# Altium schematic sheet PwrConfig.SchDoc
size A; SheetNumber: 2; SheetTotal: 2; DocumentName: Power and Configuration
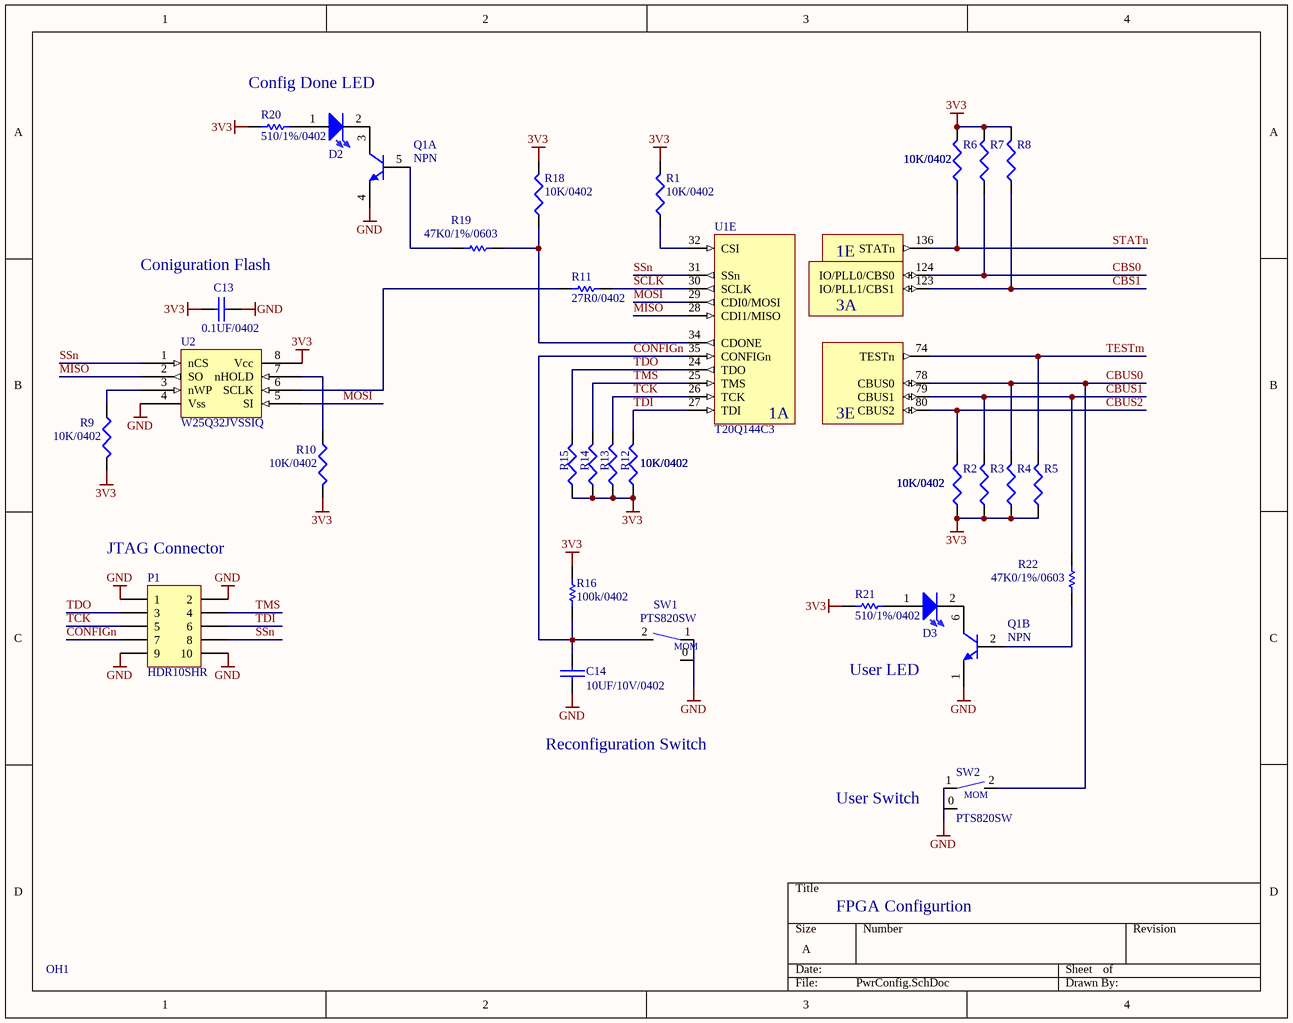
[diagram p0: PwrConfig.SchDoc]

## Parts
C13  0.1UF/0402  [0402]
C14  10UF/10V/0402  [0402]
D2  LTST-C191KGKT  [LED0603]  (value not drawn)
D3  LTST-C191KGKT  [LED0603]  (value not drawn)
OH1  OPENHW_SCH  (value not drawn)
P1  HDR10SHR  [HDR10]
Q1  NPN  [SC70-6_HAND]  (parts A,B of 2)
R1  10K/0402  [0402]
R2  10K/0402  [0402]
R3  10K/0402  [0402]
R4  10K/0402  [0402]
R5  10K/0402  [0402]
R6  10K/0402  [0402]
R7  10K/0402  [0402]
R8  10K/0402  [0402]
R9  10K/0402  [0402]
R10  10K/0402  [0402]
R11  27R0/0402  [0402]
R12  10K/0402  [0402]
R13  10K/0402  [0402]
R14  10K/0402  [0402]
R15  10K/0402  [0402]
R16  100k/0402  [0402]
R18  10K/0402  [0402]
R19  47K0/1%/0603  [0402]
R20  510/1%/0402  [0402]
R21  510/1%/0402  [0402]
R22  47K0/1%/0603  [0402]
SW1  PTS820SW  [PTS820]
SW2  PTS820SW  [PTS820]
U1  T20Q144C3  [LQFP144]  (part E of 6)
U2  W25Q32JVSSIQ  [so8w]

## Nets
3V3: C13.2 R1.2 R2.1 R3.1 R4.1 R5.1 R6.2 R7.2 R8.2 R9.2 R10.2 R12.1 R13.1 R14.1 R15.1 R16.2 R18.2 R20.2 R21.2 U2.8(Vcc)
GND: C13.1 C14.2 P1.1 P1.2 P1.9 P1.10 Q1.1 Q1.4 SW1.1 SW2.1 U2.4(Vss)
CBS0: R7.1 U1.124(IO/PLL0/CBS0)
CBS1: R8.1 U1.123(IO/PLL1/CBS1)
CBUS0: R4.2 SW2.2 U1.78(CBUS0)
CBUS1: R3.2 R22.2 U1.79(CBUS1)
CBUS2: R2.2 U1.80(CBUS2)
CONFIGn: C14.1 P1.7 R16.1 SW1.2 U1.35(CONFIGn)
MISO: U1.28(CDI1/MISO) U2.2(SO)
MOSI: U1.29(CDI0/MOSI) U2.5(SI)
SCLK: R11.1 U1.30(SCLK)
SSn: P1.8 U1.31(SSn) U2.1(nCS)
STATn: R6.1 U1.136(STATn)
TCK: P1.5 R13.2 U1.26(TCK)
TDI: P1.6 R12.2 U1.27(TDI)
TDO: P1.3 R15.2 U1.24(TDO)
TESTm: R5.2 U1.74(TESTn)
TMS: P1.4 R14.2 U1.25(TMS)
NetD2_1: D2.1(A) R20.1
NetD2_2: D2.2(K) Q1.3
NetD3_1: D3.1(A) R21.1
NetD3_2: D3.2(K) Q1.6
NetQ1_2: Q1.2 R22.1
NetQ1_5: Q1.5 R19.1
NetR1_1: R1.1 U1.32(CSI)
NetR9_1: R9.1 U2.3(nWP)
NetR10_1: R10.1 U2.7(nHOLD)
NetR11_2: R11.2 U2.6(SCLK)
NetR18_1: R18.1 R19.2 U1.34(CDONE)

Not connected (* = marked no-connect by the designer): SW1 0; SW2 0

## Notes on the sheet
- Config Done LED
- (near C13) Coniguration Flash
- (near P1) JTAG Connector
- User LED
- Reconfiguration Switch
- (near SW2) User Switch
- FPGA Configurtion
- (in symbol PTS820SW) MOM
- (in symbol T20Q144C3, part E) 1E; 3A; 1A; 3E

## Library data of the parts
C13 = 0.1UF/16v/0402: ±10% 16V Ceramic Capacitor X7R 0402 (1005 Metric); MFG: TDK; MFG PN: CGA2B1X7R1C104K050BC; DK PN: 445-5613-1-ND; Price: 1.17
C14 = 10UF/10V/0402: ±20% 10V Ceramic Capacitor X5R 0402 (1005 Metric); MFG: Samsung; MFG PN: CL05A106MP8NUB8; DK PN: 1276-6830-1-ND; Price: 1.17
D2 D3 = LTST-C191KGKT: Green 571nm LED Indication - Discrete 2V 0603 (1608 Metric); DK PN: 160-1446-1-ND; MFG: Liteon; MFG PN: LTST-C191KGKT; Populate: *
P1 = HDR10SHR: Connector Header Through Hole 10 position 0.100" (2.54mm); MFG: On Shore; MFG PN: 302-S101; DK PN: ED1543-ND; Populate: *
Q1 = MBT3904DW1T1G: Bipolar (BJT) Transistor Array 2 NPN (Dual) 40V 200mA 300MHz 150mW Surface Mount SC-88/SC70-6/SOT-363; MFG: On Semi; DK PN: MBT3904DW1T1GOSCT-ND; MFG PN: MBT3904DW1T1G; Price: 0.58000
R1-R10 R12-R15 R18 = 10K/0402: 10 kOhms ±1% 0.063W, 1/16W Chip Resistor 0402 (1005 Metric) Automotive AEC-Q200, Moisture Resistant Thick Film; MFG: Yaego; MFG PN: AC0402FR-0710KL; DK PN: YAG3436CT-ND; Price: 5.02
R11 = 27R0/0402: 27 Ohms ±1% 0.063W, 1/16W Chip Resistor 0402 (1005 Metric) Moisture Resistant Thick Film; MFG PN: RC0402FR-0727RL; DK PN: YAG3086CT-ND; MFG: Yageo; Populate: *
R16 = 100k/0402: 100 kOhms ±1% 0.063W, 1/16W Chip Resistor 0402 (1005 Metric) Automotive AEC-Q200 Thick Film; MFG PN: RMCF0402FT100K; DK PN: RMCF0402FT100KCT-ND; MFG: Stackpole; Populate: *
R19 R22 = RES1K00_1: 47 kOhms ±1% 0.063W, 1/16W Chip Resistor 0402 (1005 Metric) Moisture Resistant Thick Film; MFG PN: RC0402FR-0747KL; DK PN: 311-47.0KLRCT-ND; MFG: Yageo; Populate: *
R20 R21 = 510/1%/0402: 510 Ohms ±1% 0.063W, 1/16W Chip Resistor 0402 (1005 Metric) Moisture Resistant Thick Film; MFG PN: RC0402FR-07510RL; DK PN: 311-510LRCT-ND; MFG: Yageo; FOOTPRINT: 0603; Populate: *
SW1 SW2 = PTS820SW: Tactile Switch SPST-NO Top Actuated Surface Mount; MFG: C&K; MFG PN: PTS820 J20M SMTR LFS; DK PN: CKN10505CT-ND
U1 = T20Q144C3: Trion® Field Programmable Gate Array (FPGA) IC 97 1044 19728 144-LQFP; MFG: Efinix; DK PN: 2134-T20Q144C3-ND; MFG PN: T20Q144C3; FOOTPRINT: 144QFP; Populate: *
U2 = W25Q32JVSSIQ: FLASH - NOR Memory IC 32Mb (4M x 8) SPI - Quad I/O 133 MHz 8-SOIC; MFG: Winbond; MFG PN: W25Q32JVSSIQ TR; DK PN: W25Q32JVSSIQCT-ND